# Altium schematic sheet 3-MCU.SchDoc: MCU
size A1; CompanyName: TRISTAR; Organization: Sherbrooke's University; Address1: Genie / GEGI; Address2: 2500 boulevard de l'universite; Address3: J1K2R SHERBROOKE; Address4: QUEBEC, CANADA
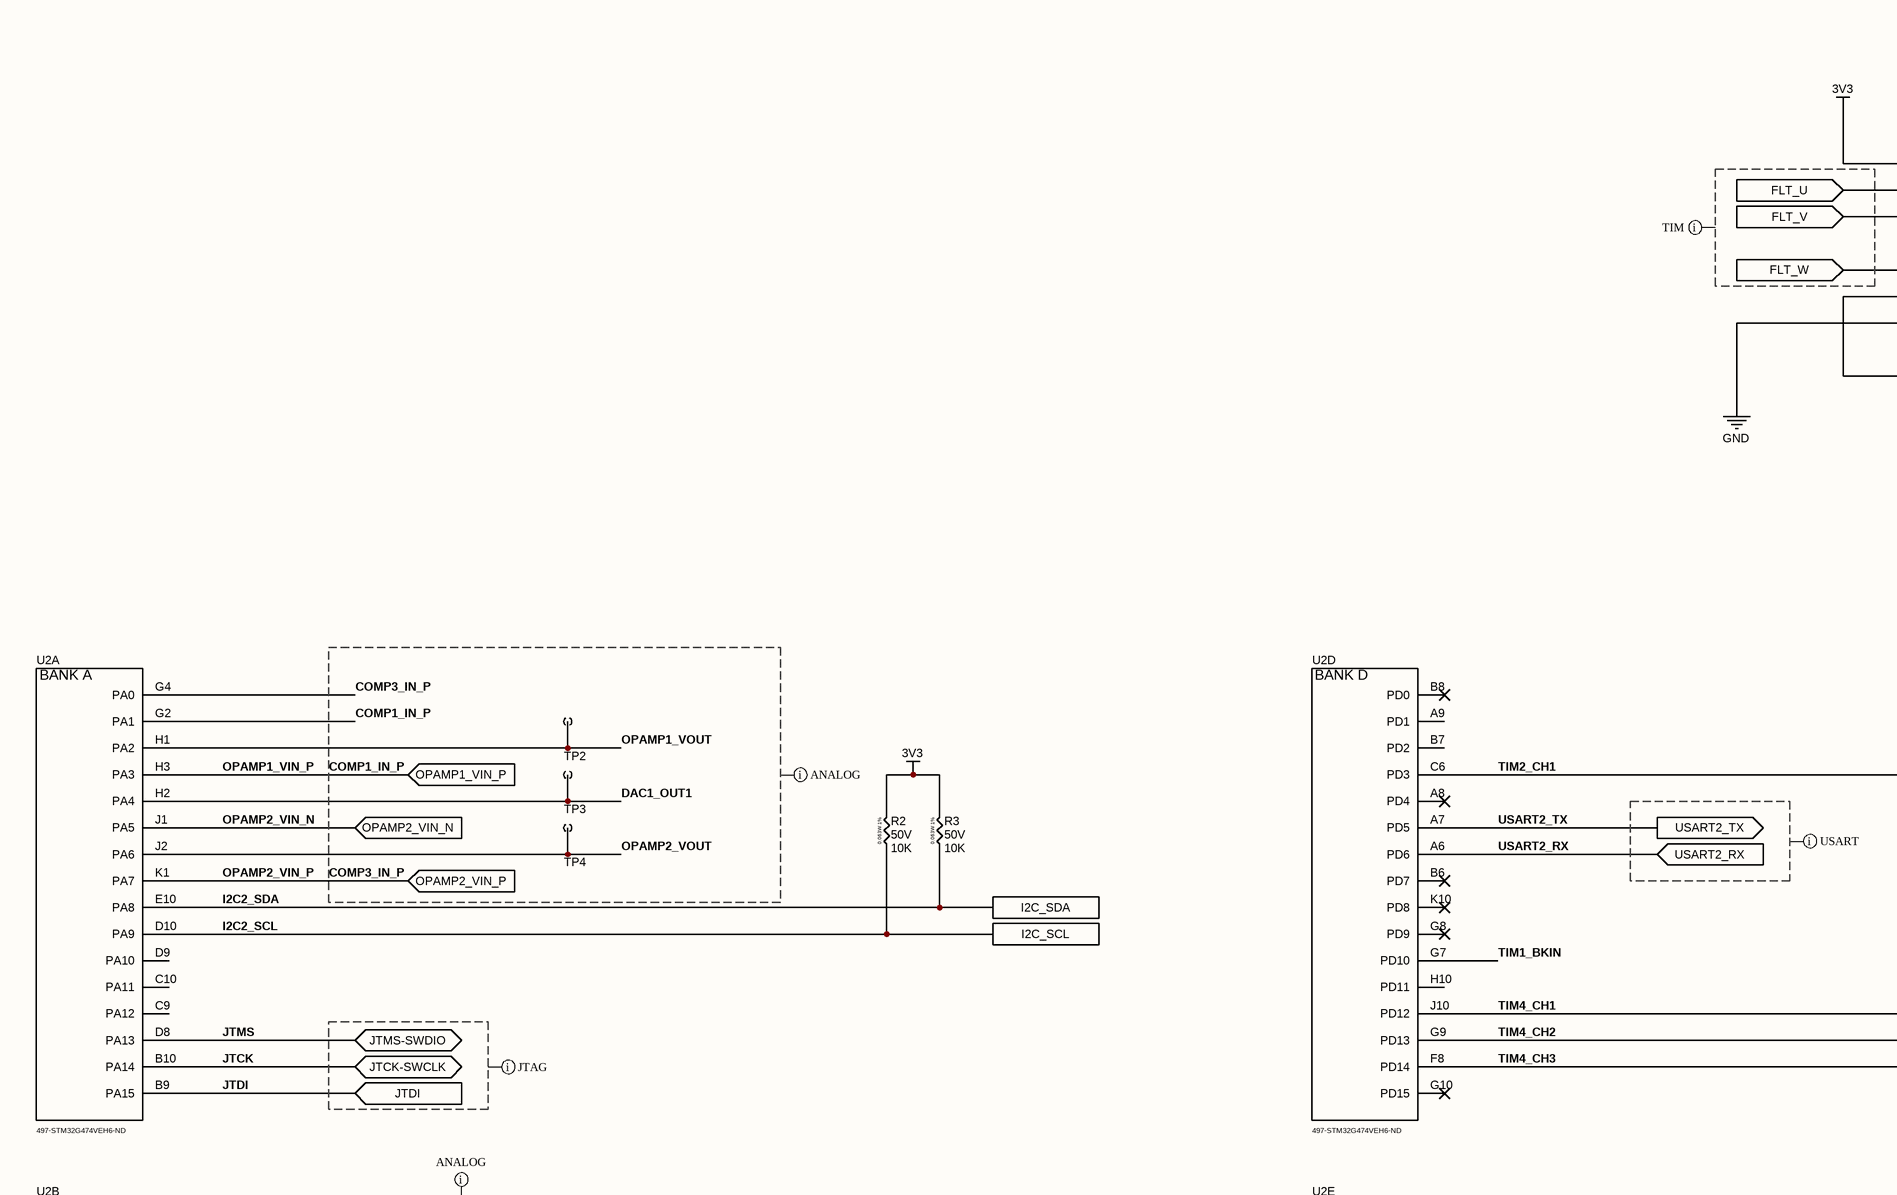
[diagram p0: 3-MCU.SchDoc, top left]
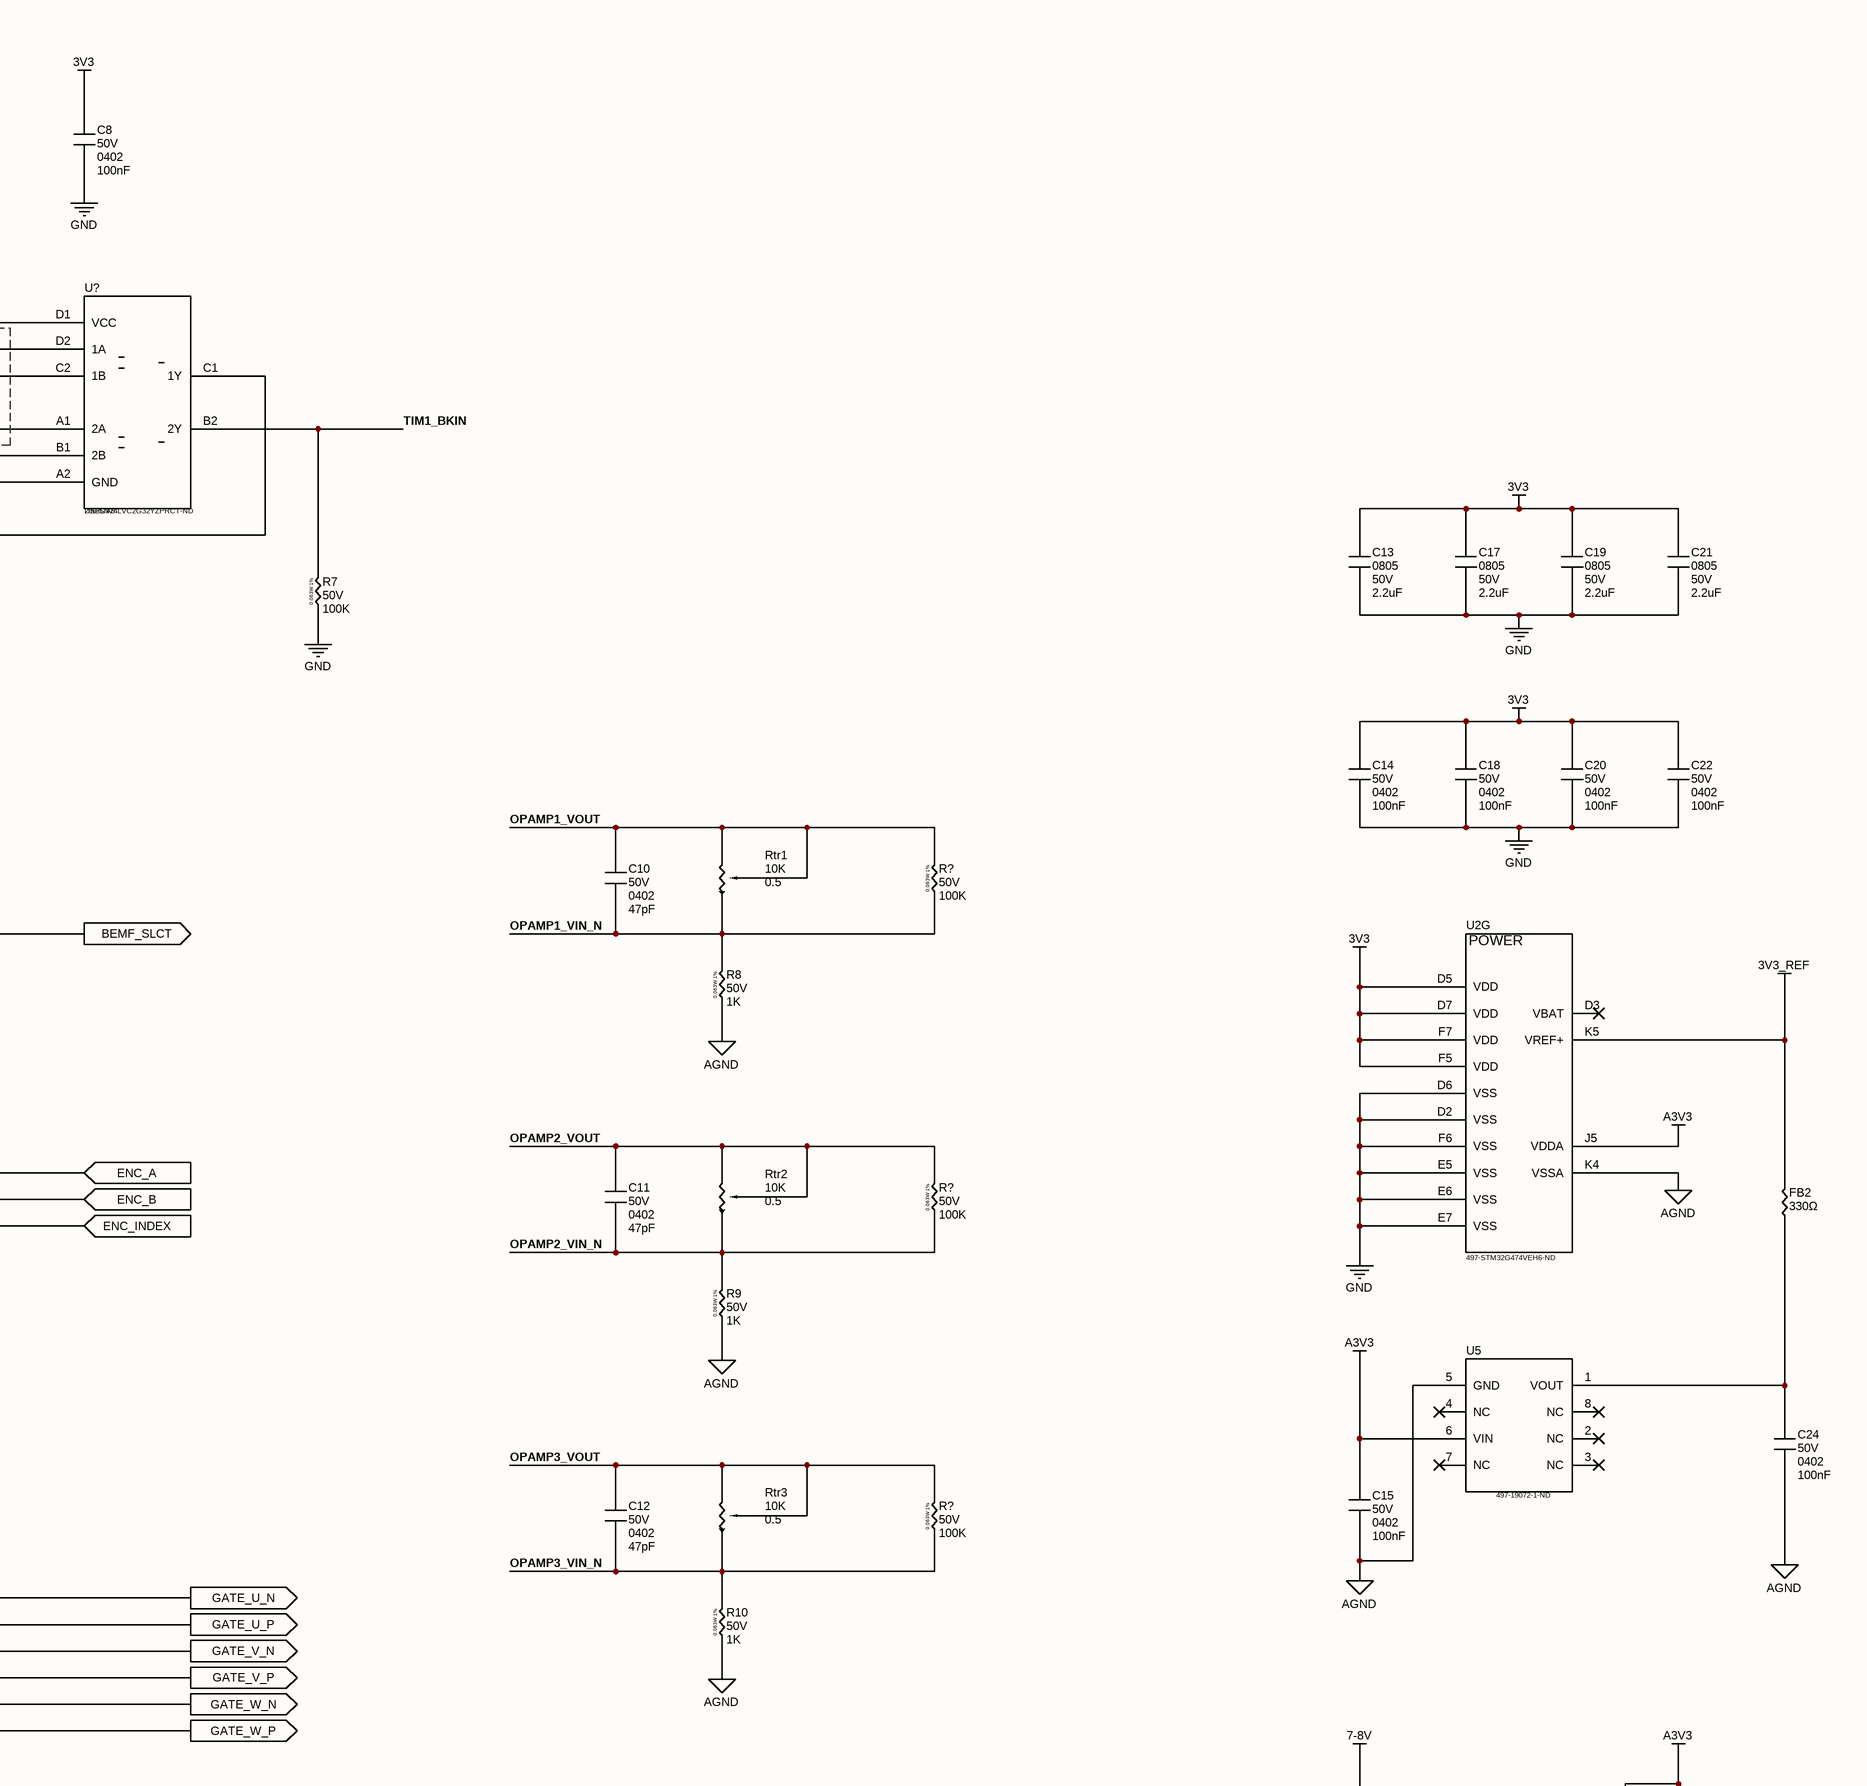
[diagram p1: 3-MCU.SchDoc, top right]
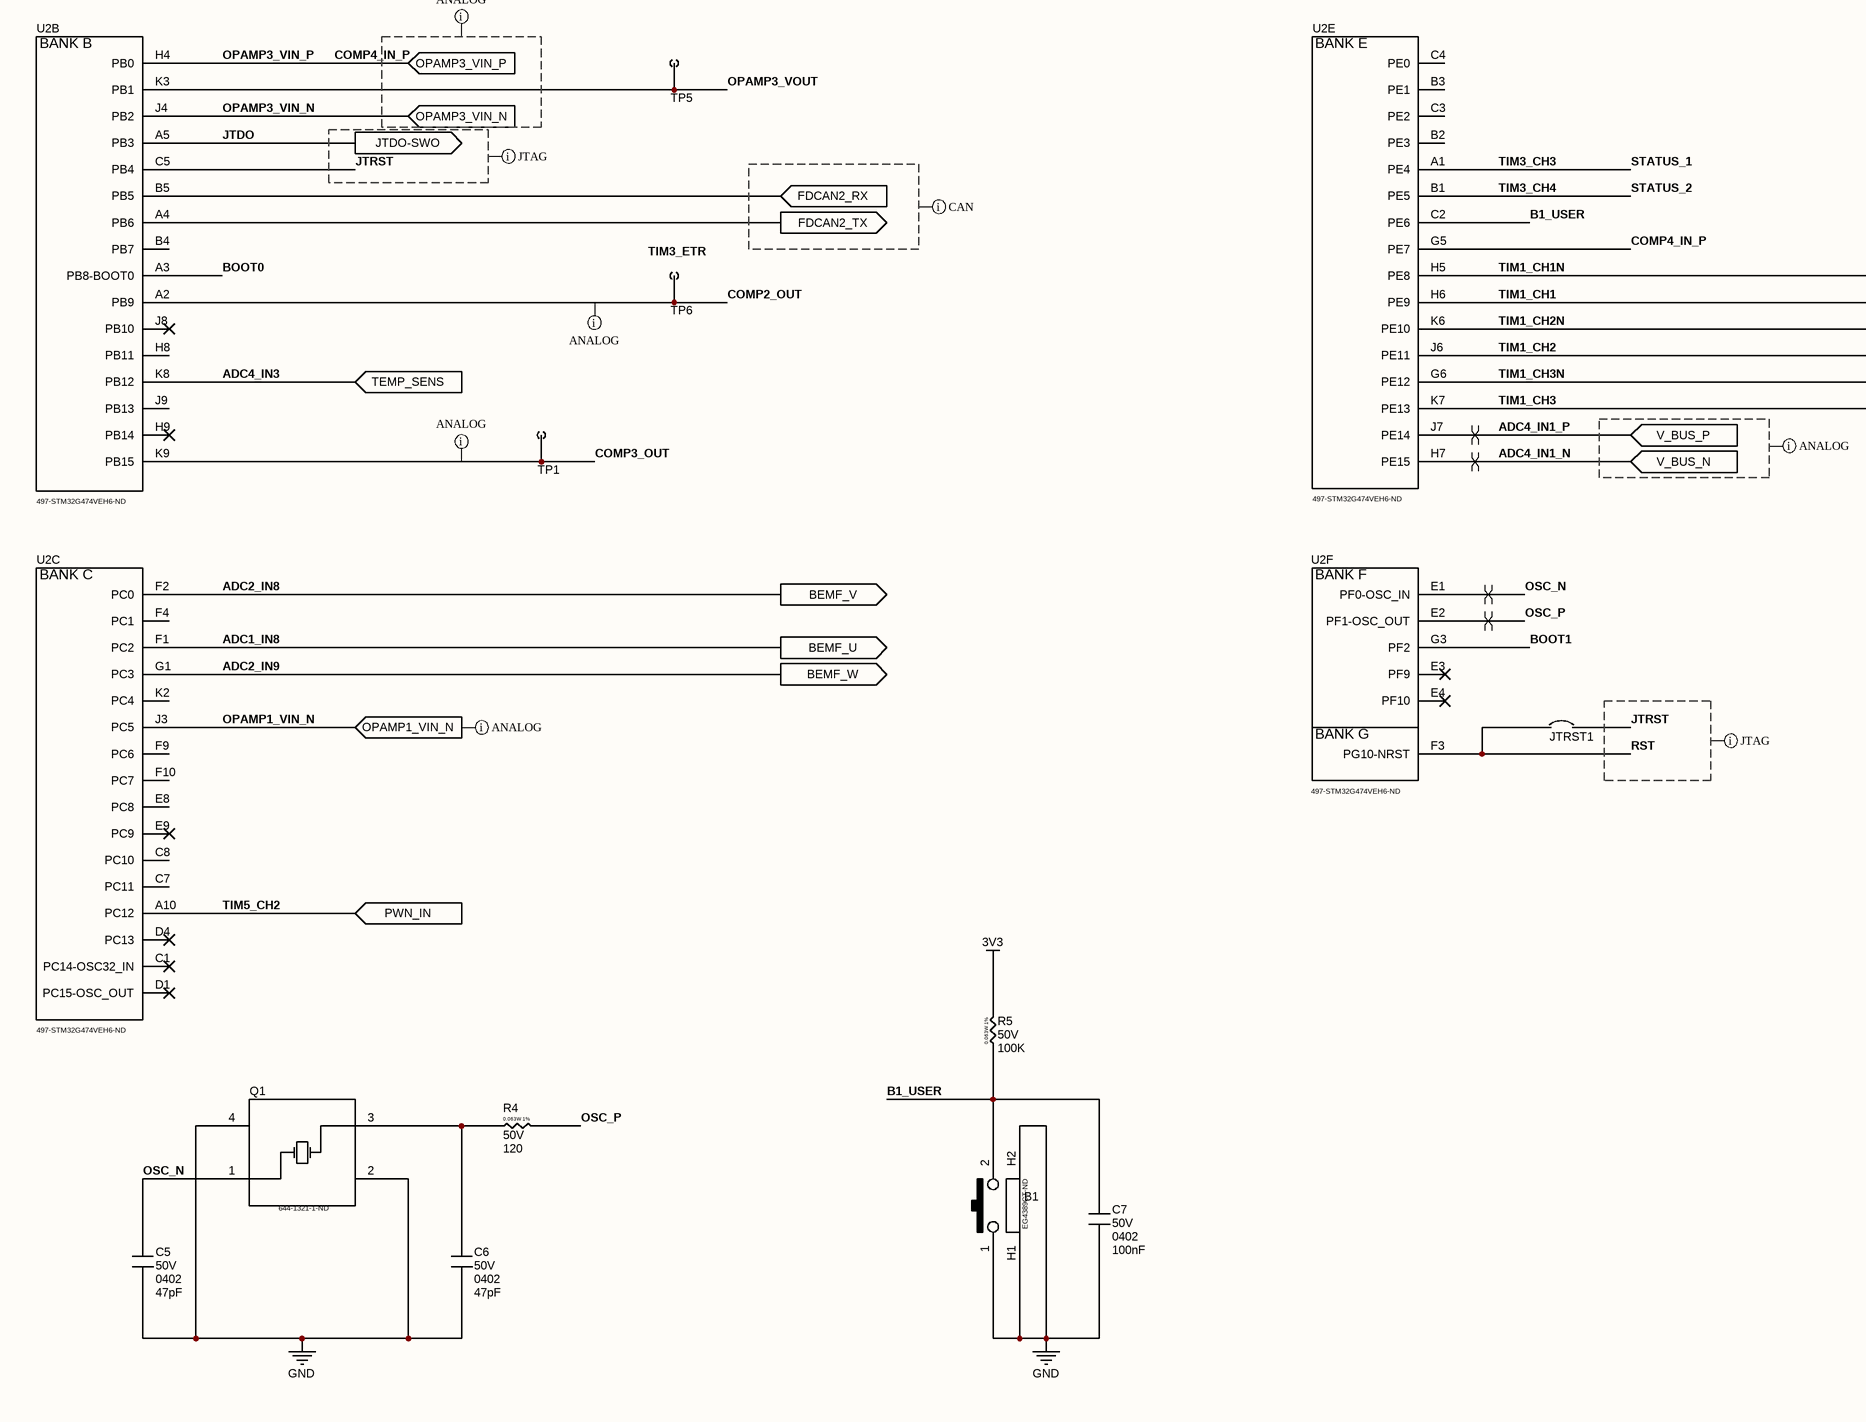
[diagram p2: 3-MCU.SchDoc, bottom left]
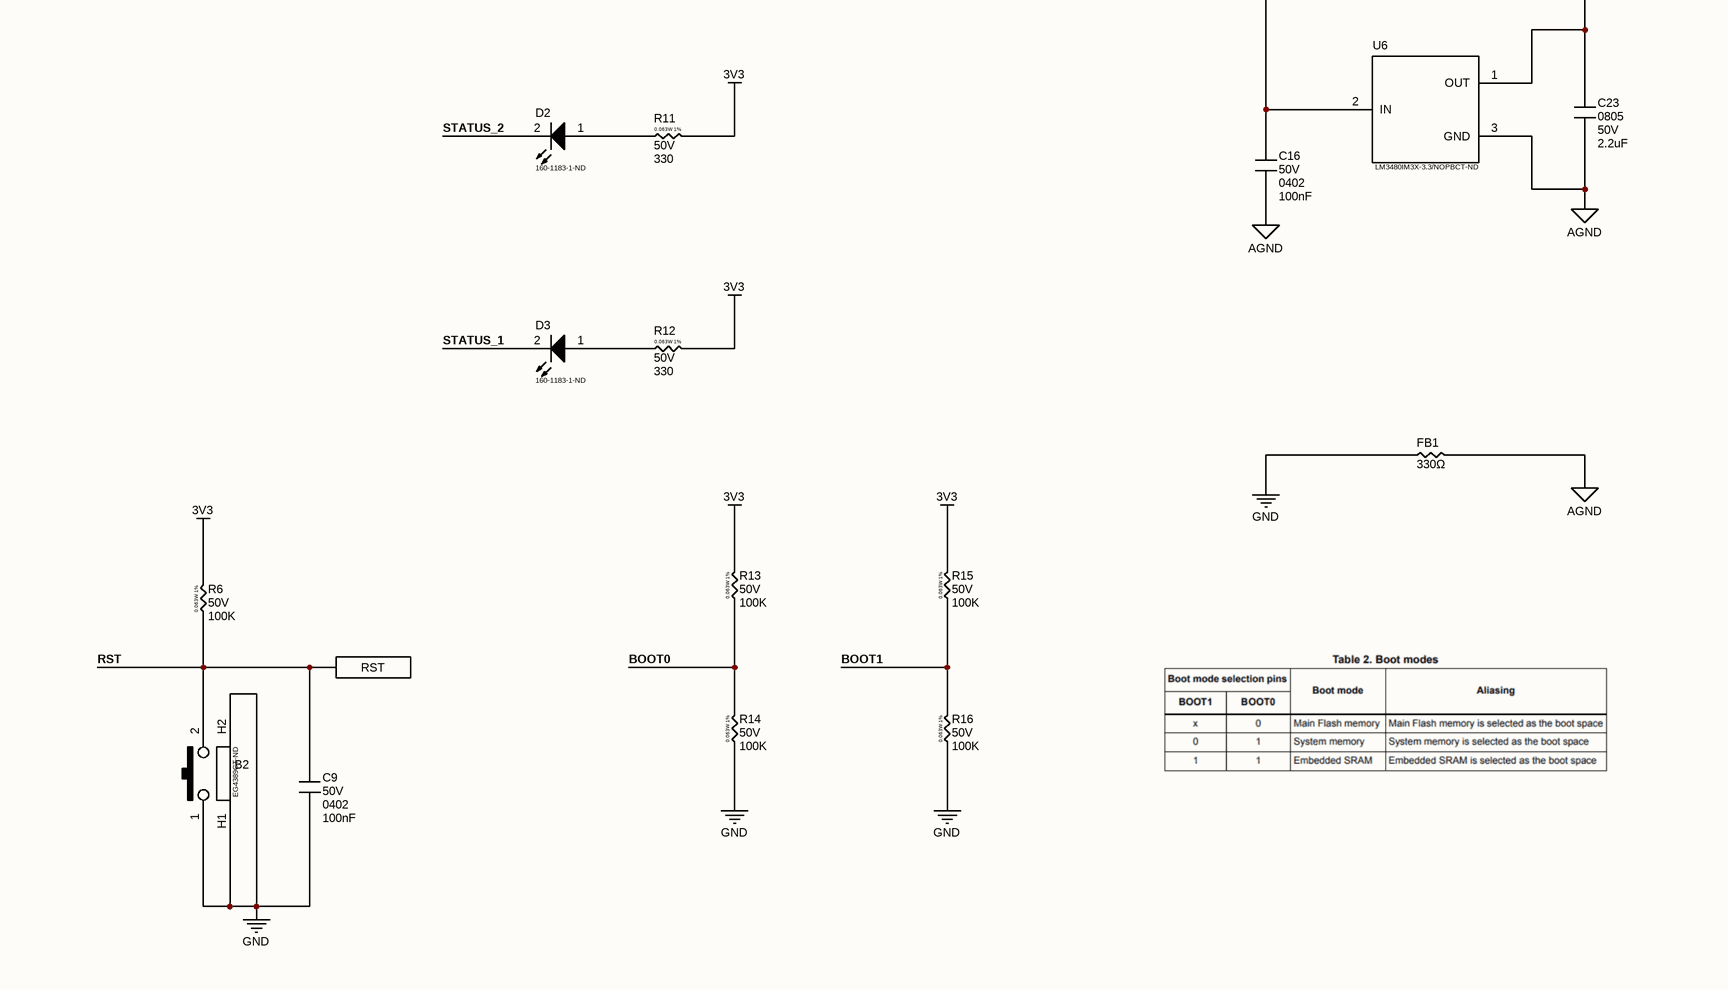
[diagram p3: 3-MCU.SchDoc, bottom right]

## Parts
(Parts that share a designator on the sheet are numbered #1, #2 ... from top to bottom, then left to right.)
B1  Supplier Part Number 1: EG4389CT-ND  [BUTTON_SINGLE_SIDE]  (hidden comment: PUSH BUTT SINGLE SIDE)
B2  Supplier Part Number 1: EG4389CT-ND  [BUTTON_SINGLE_SIDE]  (hidden comment: PUSH BUTT SINGLE SIDE)
C5  VDC: 50V  Package: 0402  [C 0402(1005)x0.5]  (hidden comment: 47pF)
C6  VDC: 50V  Package: 0402  [C 0402(1005)x0.5]  (hidden comment: 47pF)
C7  VDC: 50V  Package: 0402  [C 0402(1005)x0.5]  (hidden comment: 100nF)
C8  VDC: 50V  Package: 0402  [C 0402(1005)x0.5]  (hidden comment: 100nF)
C9  VDC: 50V  Package: 0402  [C 0402(1005)x0.5]  (hidden comment: 100nF)
C10  VDC: 50V  Package: 0402  [C 0402(1005)x0.5]  (hidden comment: 47pF)
C11  VDC: 50V  Package: 0402  [C 0402(1005)x0.5]  (hidden comment: 47pF)
C12  VDC: 50V  Package: 0402  [C 0402(1005)x0.5]  (hidden comment: 47pF)
C13  Package: 0805  VDC: 50V  [C 0805(2012)x0.65]  (hidden comment: 2.2uF)
C14  VDC: 50V  Package: 0402  [C 0402(1005)x0.5]  (hidden comment: 100nF)
C15  VDC: 50V  Package: 0402  [C 0402(1005)x0.5]  (hidden comment: 100nF)
C16  VDC: 50V  Package: 0402  [C 0402(1005)x0.5]  (hidden comment: 100nF)
C17  Package: 0805  VDC: 50V  [C 0805(2012)x0.65]  (hidden comment: 2.2uF)
C18  VDC: 50V  Package: 0402  [C 0402(1005)x0.5]  (hidden comment: 100nF)
C19  Package: 0805  VDC: 50V  [C 0805(2012)x0.65]  (hidden comment: 2.2uF)
C20  VDC: 50V  Package: 0402  [C 0402(1005)x0.5]  (hidden comment: 100nF)
C21  Package: 0805  VDC: 50V  [C 0805(2012)x0.65]  (hidden comment: 2.2uF)
C22  VDC: 50V  Package: 0402  [C 0402(1005)x0.5]  (hidden comment: 100nF)
C23  Package: 0805  VDC: 50V  [C 0805(2012)x0.65]  (hidden comment: 2.2uF)
C24  VDC: 50V  Package: 0402  [C 0402(1005)x0.5]  (hidden comment: 100nF)
D2  Supplier Part Number 1: 160-1183-1-ND  [LED 0603]  (hidden comment: LED 0603)
D3  Supplier Part Number 1: 160-1183-1-ND  [LED 0603]  (hidden comment: LED 0603)
FB1  ZTyp@100MHz: 330Ω  [FB 0805(2012)]  (hidden comment: 0.525u)
FB2  ZTyp@100MHz: 330Ω  [FB 0805(2012)]  (hidden comment: 0.525u)
JTRST1  SHORT_PARALLEL  [SHORT_PARALLEL]  (value not drawn)  (net tie, no BOM)
Q1  Supplier Part Number 1: 644-1321-1-ND  [QUARTZ_1]  (hidden comment: OSC NX2016)
R2  VDC: 50V  [R 0402(1005)-1%]  (hidden comment: 10K)
R3  VDC: 50V  [R 0402(1005)-1%]  (hidden comment: 10K)
R4  VDC: 50V  [R 0402(1005)-1%]  (hidden comment: 120)
R5  VDC: 50V  [R 0402(1005)-1%]  (hidden comment: 100K)
R6  VDC: 50V  [R 0402(1005)-1%]  (hidden comment: 100K)
R7  VDC: 50V  [R 0402(1005)-1%]  (hidden comment: 100K)
R8  VDC: 50V  [R 0402(1005)-1%]  (hidden comment: 1K)
R9  VDC: 50V  [R 0402(1005)-1%]  (hidden comment: 1K)
R10  VDC: 50V  [R 0402(1005)-1%]  (hidden comment: 1K)
R11  VDC: 50V  [R 0402(1005)-1%]  (hidden comment: 330)
R12  VDC: 50V  [R 0402(1005)-1%]  (hidden comment: 330)
R13  VDC: 50V  [R 0402(1005)-1%]  (hidden comment: 100K)
R14  VDC: 50V  [R 0402(1005)-1%]  (hidden comment: 100K)
R15  VDC: 50V  [R 0402(1005)-1%]  (hidden comment: 100K)
R16  VDC: 50V  [R 0402(1005)-1%]  (hidden comment: 100K)
R?#1  VDC: 50V  [R 0402(1005)-1%]  (hidden comment: 100K)
R?#2  VDC: 50V  [R 0402(1005)-1%]  (hidden comment: 100K)
R?#3  VDC: 50V  [R 0402(1005)-1%]  (hidden comment: 100K)
Rtr1  Set Position: 0.5  [Rtr SMD3]  (hidden comment: 10K)
Rtr2  Set Position: 0.5  [Rtr SMD3]  (hidden comment: 10K)
Rtr3  Set Position: 0.5  [Rtr SMD3]  (hidden comment: 10K)
TP1  TP ROUND  [TP_ROUND]  (value not drawn)  (no BOM)
TP2  TP ROUND  [TP_ROUND]  (value not drawn)  (no BOM)
TP3  TP ROUND  [TP_ROUND]  (value not drawn)  (no BOM)
TP4  TP ROUND  [TP_ROUND]  (value not drawn)  (no BOM)
TP5  TP ROUND  [TP_ROUND]  (value not drawn)  (no BOM)
TP6  TP ROUND  [TP_ROUND]  (value not drawn)  (no BOM)
U2  Supplier Part Number 1: 497-STM32G474VEH6-ND  [TFBGA-100]  (hidden comment: STM32 TFBGA 100)  (parts A,B,C,D,E,F,G of 7)
U5  Supplier Part Number 1: 497-19072-1-ND  [QFN8_2_2]  (hidden comment: QFN8)
U6  Supplier Part Number 1: LM3480IM3X-3.3/NOPBCT-ND  [SOT23_3_0.95_1.6]  (hidden comment: SOT23)
U?  DSBGA8  Supplier Part Number 1: 296-SN74LVC2G32YZPRCT-ND  [DSBGA-8]

## Ports
BEMF_SLCT (out), BEMF_U (out), BEMF_V (out), BEMF_W (out), ENC_A (in), ENC_B (in), ENC_INDEX (in), FDCAN2_RX (in), FDCAN2_TX (out), FLT_U (in), FLT_V (in), FLT_W (in), GATE_U_N (out), GATE_U_P (out), GATE_V_N (out), GATE_V_P (out), GATE_W_N (out), GATE_W_P (out), I2C_SCL, I2C_SDA, JTCK-SWCLK (bidir), JTDI (in), JTDO-SWO (out), JTMS-SWDIO (bidir), OPAMP1_VIN_N (in), OPAMP1_VIN_P (in), OPAMP2_VIN_N (in), OPAMP2_VIN_P (in), OPAMP3_VIN_N (in), OPAMP3_VIN_P (in), PWN_IN (in), RST, TEMP_SENS (in), USART2_RX (in), USART2_TX (out), V_BUS_N (in), V_BUS_P (in)

## Nets
3V3: C8.1 C13.1 C14.1 C17.1 C18.1 C19.1 C20.1 C21.1 C22.1 R2.2 R3.2 R5.2 R6.2 R11.2 R12.2 R13.2 R15.2 U2.D5(VDD) U2.D7(VDD) U2.F5(VDD) U2.F7(VDD) U?.D1(VCC)
3V3_REF: FB2.2 U2.K5(VREF+)
7-8V: C16.1 U6.2(IN)
A3V3: C15.1 C23.1 U2.J5(VDDA) U5.6(VIN) U6.1(OUT)
AGND: C15.2 C16.2 C23.2 C24.2 FB1.2 R8.1 R9.1 R10.1 U2.K4(VSSA) U5.5(GND) U6.3(GND)
GND: B1.1 B1.H1 B1.H2 B2.1 B2.H1 B2.H2 C5.2 C6.2 C7.2 C8.2 C9.2 C13.2 C14.2 C17.2 C18.2 C19.2 C20.2 C21.2 C22.2 FB1.1 Q1.2 Q1.4(GND) R7.1 R14.1 R16.1 U2.D2(VSS) U2.D6(VSS) U2.E5(VSS) U2.E6(VSS) U2.E7(VSS) U2.F6(VSS) U?.A2(GND)
ADC1_IN8: U2.F1(PC2) ; port BEMF_U
ADC2_IN8: U2.F2(PC0) ; port BEMF_V
ADC2_IN9: U2.G1(PC3) ; port BEMF_W
ADC4_IN1_N: U2.H7(PE15) ; port V_BUS_N
ADC4_IN1_P: U2.J7(PE14) ; port V_BUS_P
ADC4_IN3: U2.K8(PB12) ; port TEMP_SENS
B1_USER: B1.2 C7.1 R5.1 U2.C2(PE6)
BOOT0: R13.1 R14.2 U2.A3(PB8-BOOT0)
BOOT1: R15.1 R16.2 U2.G3(PF2)
COMP1_IN_P: U2.G2(PA1) U2.H3(PA3) ; port OPAMP1_VIN_P  [also labelled OPAMP1_VIN_P]
COMP2_OUT: TP6.1 U2.A2(PB9)
COMP3_IN_P: U2.G4(PA0) U2.K1(PA7) ; port OPAMP2_VIN_P  [also labelled OPAMP2_VIN_P]
COMP3_OUT: TP1.1 U2.K9(PB15)
COMP4_IN_P: U2.G5(PE7) U2.H4(PB0) ; port OPAMP3_VIN_P  [also labelled OPAMP3_VIN_P]
DAC1_OUT1: TP3.1 U2.H2(PA4)
FDCAN2_RX: U2.B5(PB5) ; port FDCAN2_RX
FDCAN2_TX: U2.A4(PB6) ; port FDCAN2_TX
FLT_U: U?.D2(1A) ; port FLT_U
FLT_V: U?.C2(1B) ; port FLT_V
FLT_W: U?.A1(2A) ; port FLT_W
I2C2_SCL: R2.1 U2.D10(PA9) ; port I2C_SCL
I2C2_SDA: R3.1 U2.E10(PA8) ; port I2C_SDA
JTCK: U2.B10(PA14) ; port JTCK-SWCLK
JTDI: U2.B9(PA15) ; port JTDI
JTDO: U2.A5(PB3) ; port JTDO-SWO
JTMS: U2.D8(PA13) ; port JTMS-SWDIO
JTRST: JTRST1.2 U2.C5(PB4)
OPAMP1_VIN_N: C10.2 R8.2 R?#1.1 Rtr1.1 U2.J3(PC5) ; port OPAMP1_VIN_N
OPAMP1_VOUT: C10.1 R?#1.2 Rtr1.2 Rtr1.3 TP2.1 U2.H1(PA2)
OPAMP2_VIN_N: C11.2 R9.2 R?#2.1 Rtr2.1 U2.J1(PA5) ; port OPAMP2_VIN_N
OPAMP2_VOUT: C11.1 R?#2.2 Rtr2.2 Rtr2.3 TP4.1 U2.J2(PA6)
OPAMP3_VIN_N: C12.2 R10.2 R?#3.1 Rtr3.1 U2.J4(PB2) ; port OPAMP3_VIN_N
OPAMP3_VOUT: C12.1 R?#3.2 Rtr3.2 Rtr3.3 TP5.1 U2.K3(PB1)
OSC_N: C5.1 Q1.1 U2.E1(PF0-OSC_IN)
OSC_P: R4.2 U2.E2(PF1-OSC_OUT)
RST: B2.2 C9.1 JTRST1.1 R6.1 U2.F3(PG10-NRST) ; port RST
STATUS_1: D3.2 U2.A1(PE4)  [also labelled TIM3_CH3]
STATUS_2: D2.2 U2.B1(PE5)  [also labelled TIM3_CH4]
TIM1_BKIN: R7.2 U2.G7(PD10) U?.B2(2Y)
TIM1_CH1: U2.H6(PE9) ; port GATE_U_P
TIM1_CH1N: U2.H5(PE8) ; port GATE_U_N
TIM1_CH2: U2.J6(PE11) ; port GATE_V_P
TIM1_CH2N: U2.K6(PE10) ; port GATE_V_N
TIM1_CH3: U2.K7(PE13) ; port GATE_W_P
TIM1_CH3N: U2.G6(PE12) ; port GATE_W_N
TIM2_CH1: U2.C6(PD3) ; port BEMF_SLCT
TIM4_CH1: U2.J10(PD12) ; port ENC_A
TIM4_CH2: U2.G9(PD13) ; port ENC_B
TIM4_CH3: U2.F8(PD14) ; port ENC_INDEX
TIM5_CH2: U2.A10(PC12) ; port PWN_IN
USART2_RX: U2.A6(PD6) ; port USART2_RX
USART2_TX: U2.A7(PD5) ; port USART2_TX
NetC6_1: C6.1 Q1.3(OSC2) R4.1
NetC24_1: C24.1 FB2.1 U5.1(VOUT)
NetD2_1: D2.1 R11.1
NetD3_1: D3.1 R12.1
NetU?_B1: U?.B1(2B) U?.C1(1Y)

Not connected (* = marked no-connect by the designer): U2 A8(PD4)* A9(PD1) B2(PE3) B3(PE1) B4(PB7) B6(PD7)* B7(PD2) B8(PD0)* C1(PC14-OSC32_IN)* C3(PE2) C4(PE0) C7(PC11) C8(PC10) C9(PA12) C10(PA11) D1(PC15-OSC_OUT)* D3(VBAT)* D4(PC13)* D9(PA10) E3(PF9)* E4(PF10)* E8(PC8) E9(PC9)* F4(PC1) F9(PC6) F10(PC7) G8(PD9)* G10(PD15)* H8(PB11) H9(PB14)* H10(PD11) J8(PB10)* J9(PB13) K2(PC4) K10(PD8)*; U5 2(NC)* 3(NC)* 4(NC)* 7(NC)* 8(NC)*

## Layout directives
differential pair: ADC4_IN1_N, ADC4_IN1_P, OSC_N, OSC_P
net class JTAG: (no net found under the mark), JTRST, RST
net class USART: (no net found under the mark)
net class CAN_BUS: (no net found under the mark)
net class ANALOG: (no net found under the mark), COMP1_IN_P, COMP2_OUT, COMP3_IN_P, COMP3_OUT, DAC1_OUT1, OPAMP1_VIN_N, OPAMP1_VOUT, OPAMP2_VOUT
net class TIM: (no net found under the mark)

## Notes on the sheet
- Labels drawn without touching a wire or pin: TIM3_ETR
- Size:
- Title:
- E
- Revision:
- Author:
- Date:
- File:
- Time:
- Sheet
- of
- (in symbol RES 0402-1%) 0.063W 1%
- (in symbol STM32G474VEH6, part A) BANK A
- (in symbol STM32G474VEH6, part B) BANK B
- (in symbol STM32G474VEH6, part C) BANK C
- (in symbol STM32G474VEH6, part D) BANK D
- (in symbol STM32G474VEH6, part E) BANK E
- (in symbol STM32G474VEH6, part F) BANK F; BANK G
- (in symbol STM32G474VEH6, part G) POWER

## Library data of the parts
B1 B2 = PUSH BUTT SINGLE SIDE: BUTTON SINGLE SIDE SMD; Supplier 1: Digi-Key
C5-C12 C14-C16 C18 C20 C22 C24 = CAP 0402 100nF 50V X7R: SMD-0402 100nF 50V X7R 10%; Part Number: CL05B104KB5NNNC; Manufacturer: Samsung; TYPE: Capacitors; Package-mm: 1005; Mount Type: SMT; Publisher: Hefest; Manufacturer Alternate: *; Part Number Alternate: *; Published: 07.04.2019; Supplier 1: Comet; Supplier 2: *; Supplier 3: *; Supplier Part Number 1: C0402 100nF 50V X7R; Supplier Part Number 2: *; Supplier Part Number 3: *; RoHS: Y; Technology: Ceramic  MLCC; Value 1: *; Value 2: *; TempCo: X7R; Tolerance %: ±10%; VAC: *; ESR Ohm: *; ComponentLink1Description: Datasheet link; ComponentLink1URL: https://store.comet.bg/download-file.php?id=11; Temperature Range: -55°C ~ +125°C; Price: 0.039
  C5 C6 C10-C12: Value: 47pF
  C7-C9 C14-C16 C18 C20 C22 C24: Value: 100nF
C13 C17 C19 C21 C23 = CAP 0805 2.2nF 50V X7R: SMD-0805 50V X7R 10%; Part Number: CL21B222KBNC; Manufacturer: Samsung; TYPE: Capacitors; Package-mm: 2012; Mount Type: SMT; Publisher: Hefest; Manufacturer Alternate: *; Part Number Alternate: *; Published: 07.04.2019; Supplier 1: Comet; Supplier 2: *; Supplier 3: *; Supplier Part Number 1: C0805 2.2nF 50V X7R SAMSUNG; Supplier Part Number 2: *; Supplier Part Number 3: *; RoHS: Y; Technology: Ceramic  MLCC; Value 1: *; Value 2: *; TempCo: X7R; Tolerance %: ±10%; VAC: *; ESR Ohm: *; ComponentLink1Description: Datasheet link; ComponentLink1URL: https://store.comet.bg/download-file.php?id=11; Temperature Range: -55°C ~ +125°C; Price: 0.026; Value: 2.2uF
D2 D3 = LED 0603: LED SMD 0603; Supplier 1: Digi-Key; PACKAGE: 0603; TYPE: LED
FB1 FB2 = FB BLM21P: SMD 0805 1.5A 330Ω/90mΩ; Part Number: BLM21PG331SN1D; Manufacturer: Murata; TYPE: Ferrite Bead; Ind: 0.525uH; DCR: 90mΩ; Material: Ferrite; Package-mm: 2012; Tolerance %: ±20%; Temperature Range: -55°C ~ +125°C; Imax: 1.5A; Irms: *; Isat: *; Value1: 90mΩ; Value2: 1.5A; Technology: Chip; Published: 07.04.2019; Publisher: Hefest; Mount Type: SMT; Package: 0805; ComponentLink1Description: Datasheet link; ComponentLink1URL: https://store.comet.bg/download-file.php?id=1453; RoHS: Y; Ztyp@1GHz: *; Manufacturer Alternate: *; Supplier 1: Comet; Supplier Part Number 1: BLM21PG331SN1D; Supplier 2: *; Supplier Part Number 2: *; Supplier 3: *; Supplier Part Number 3: *; Part Number Alternate: *; Price: 0.032; Value: 0.525u
JTRST1 = SHORT_PARALLEL: SHORTABLE PARALLEL PCB LINK
Q1 = OSC NX2016: OSC NX2016 24MHz; Supplier 2: Digi-Key; Supplier 1: Digi-Key
R2-R16 R?#1-R?#3 = RES 0402-1%: SMD 0402 0.063W 1% 50V; Manufacturer: YAGEO; TempCo: ±100ppm/°C; Package-mm: 1005; Value Code: 1001; Power: 0.0625W; Part Number: *; Mount Type: SMT; Publisher: Hefest; Manufacturer Alternate: *; Published: 07.04.2019; Supplier 1: Comet; Supplier 2: *; Supplier 3: *; Supplier Part Number 1: R0402 1.0K 1% YAG/ASJ; Supplier Part Number 2: *; Supplier Part Number 3: *; RoHS: Y; Technology: Thick film; Value 2: *; Package: 0402; Tolerance %: ±1%; ComponentLink1Description: Datasheet link; ComponentLink1URL: https://store.comet.bg/download-file.php?id=1224; Temperature Range: -55°C ~ +155°C; Price: 0.015; Part Number Alternate: *; TYPE: Resistor; Value 1: *
  R2 R3: Value: 10K
  R4: Value: 120
  R5-R7 R13-R16 R?#1-R?#3: Value: 100K
  R8-R10: Value: 1K
  R11 R12: Value: 330
Rtr1-Rtr3 = RES Trim TC33X-2: SMD Trimpot 3mm 0.1W 25%; Part Number: TC33X-2-102E; Manufacturer: Bourns; TempCo: ±250ppm/°C; Tolerance %: ±5%; Package-mm: 3.0x3.8x1.2mm; Value Code: 102; Rotational Cycling: 20; Mount Type: SMT; Publisher: Hefest; Manufacturer Alternate: *; Published: 07.04.2019; Supplier 1: Comet; Supplier 2: *; Supplier 3: *; Supplier Part Number 1: TC33X-2 1K; Supplier Part Number 2: *; Supplier Part Number 3: *; RoHS: Y; Technology: Thick film; Value 2: *; Package: 3mm; VDC: *; ComponentLink1Description: Datasheet link; ComponentLink1URL: https://store.comet.bg/download-file.php?id=5079; Temperature Range: -40°C ~ +100°C; Price: 0.23; Part Number Alternate: *; TYPE: TrimPot; Value 1: *; Power: 0.1W; Value: 10K
U2 = STM32G474VEH6: TFBGA100; [Author]: Alexandre Cosneau; Parameter 1: *; Supplier 1: Digi-Key
U5 = TS33: REF VOLTAGE 3V3 -- DETROMPEUR WRONG DIRECTION; Supplier 1: Digi-Key
U6 = LM3480: LDO 3V3 VIN 35V; Supplier 1: Digi-Key; TYPE: LDO; PACKAGE: SOT23
U? = SN74LVC2G32_BGA: OR DUAL; TYPE: NOR; PACKAGE 1: DSBGA8; Supplier 1: Digi-Key
TP1-TP6 = TP ROUND: TYPE: TestPoint; Technology: PCB; Value: Tp; Mount Type: SMT; Package: TestPoint; Published: 07.04.2019; Publisher: Hefest